# EasyEDA Pro project PCB_SCH_Left_Sub.epro

# Schematic left_sub
Board Name: left_sub; Create Date: 2025-10-24; Page Name: Sheet_1; Project Name: SCH_left_sub; Schematic Name: left_sub; Update Date: 2025-10-23; Add into BOM: yes; Company: Your Company; Convert to PCB: yes; Date: 10/24/2025; Draw By: Habana; REV: 1.0; Sheet: 1/1; spicePre: .
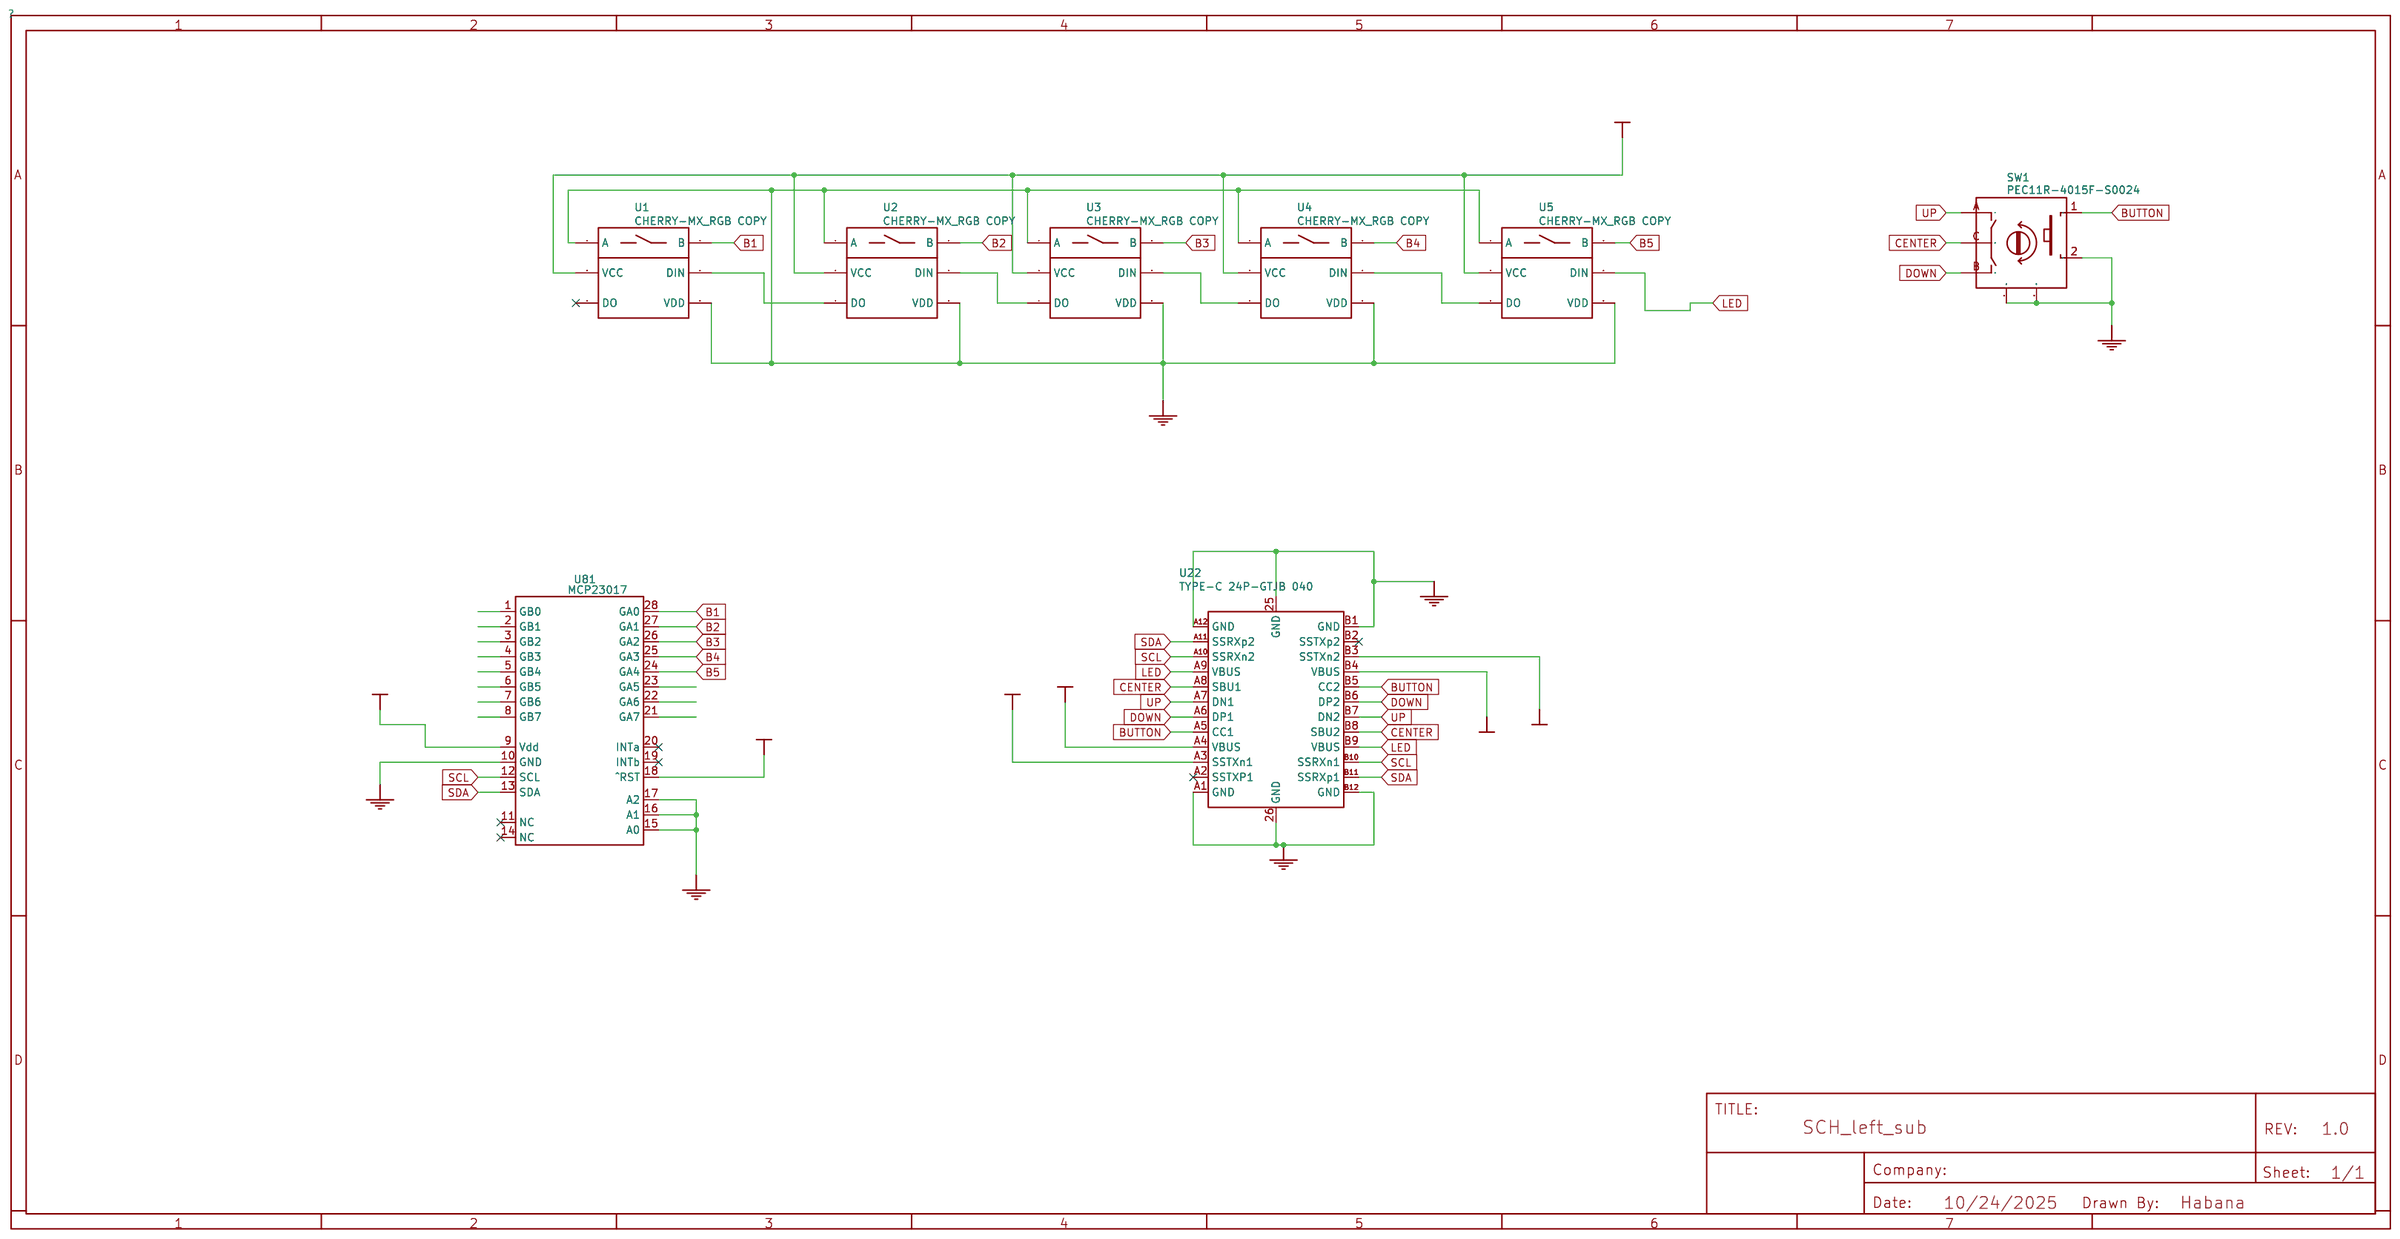
[diagram p0: schematic sheet]

## Parts
SW1  PEC11R-4015F-S0024  [SW-TH_PEC11R-4XXXF-SXXXX]
U1  CHERRY-MX_RGB COPY
U2  CHERRY-MX_RGB COPY
U3  CHERRY-MX_RGB COPY
U4  CHERRY-MX_RGB COPY
U5  CHERRY-MX_RGB COPY
U22  TYPE-C 24P-GTJB 040  [USB-C-SMD_TYPE-C-24P-GTJB-040]
U81  MCP23017

## Library data of the parts
SW1 = PEC11R-4015F-S0024: Supplier: LCSC; Supplier Part: C143789; Manufacturer: BOURNS; JLCPCB Part Class: Extended Part; Contributor: LCSC; spicePre: S
U1-U5 = CHERRY-MX_RGB COPY: Contributor: unrealin01; spicePre: U
U22 = TYPE-C 24P-GTJB 040: Supplier: LCSC; Supplier Part: C3151751; Manufacturer: SHOU HAN(首韩); JLCPCB Part Class: Extended Part; Contributor: lcsc; spicePre: U
U81 = MCP23017: nameAlias: Model; catid: 20; spicePre: X; Contributor: tsvstar

## Nets
+5V: U1.3(VCC) U2.3(VCC) U3.3(VCC) U4.3(VCC) U5.3(VCC) U22.A4(VBUS) U22.B4(VBUS)
GND: SW1.2 SW1.MT1 SW1.MT2 U1.1(A) U1.5(VDD) U2.1(A) U2.5(VDD) U3.1(A) U3.5(VDD) U4.1(A) U4.5(VDD) U5.1(A) U5.5(VDD) U22.25(GND) U22.26(GND) U22.A1(GND) U22.A12(GND) U22.B1(GND) U22.B12(GND) U81.10(GND) U81.15(A0) U81.16(A1) U81.17(A2)
VCC: U22.A3(SSTXn1) U22.B3(SSTXn2) U81.9(Vdd) U81.18(^RST)
B1: U1.2(B) U81.28(GA0)
B2: U2.2(B) U81.27(GA1)
B3: U3.2(B) U81.26(GA2)
B4: U4.2(B) U81.25(GA3)
B5: U5.2(B) U81.24(GA4)
BUTTON: SW1.1 U22.A5(CC1) U22.B5(CC2)
CENTER: SW1.C U22.A8(SBU1) U22.B8(SBU2)
DOWN: SW1.B U22.A6(DP1) U22.B6(DP2)
LED: U5.6(DIN) U22.A9(VBUS) U22.B9(VBUS)
SCL: U22.A10(SSRXn2) U22.B10(SSRXn1) U81.12(SCL)
SDA: U22.A11(SSRXp2) U22.B11(SSRXp1) U81.13(SDA)
UP: SW1.A U22.A7(DN1) U22.B7(DN2)
U2_4: U1.6(DIN) U2.4(DO)
U3_4: U2.6(DIN) U3.4(DO)
U4_4: U3.6(DIN) U4.4(DO)
U5_4: U4.6(DIN) U5.4(DO)

Not connected (* = marked no-connect by the designer): U1 4(DO)*; U22 A2(SSTXP1)* B2(SSTXp2)*; U81 1(GB0) 2(GB1) 3(GB2) 4(GB3) 5(GB4) 6(GB5) 7(GB6) 8(GB7) 11(NC)* 14(NC)* 19(INTb)* 20(INTa)* 21(GA7) 22(GA6) 23(GA5)

# Board PCB_PCB_left_sub
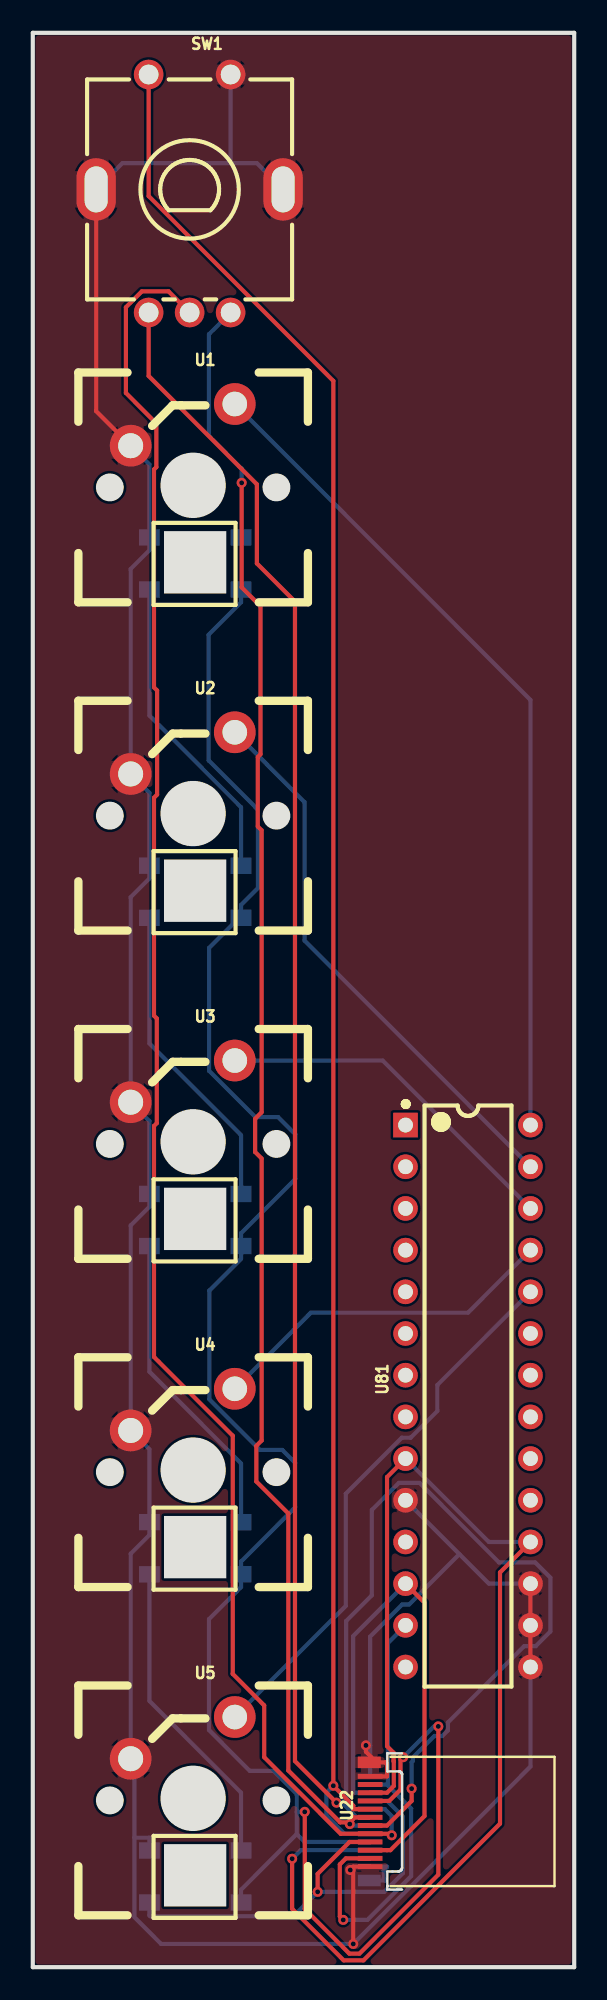
[diagram p1: board, top side]
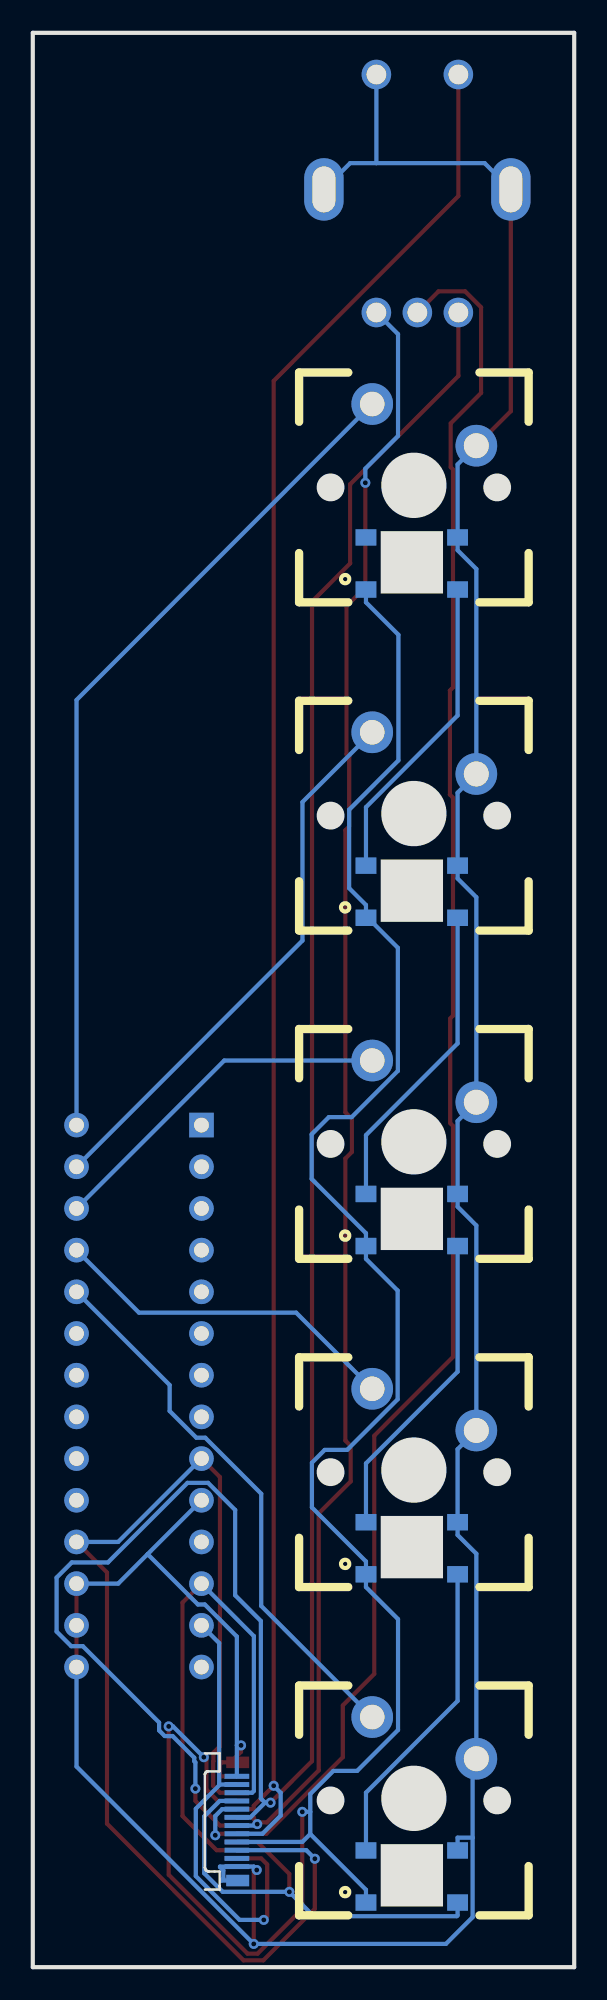
[diagram p2: board, bottom side, seen from below]

Outline 33.02 x 117.86 mm; copper layers: Top Layer, Bottom Layer. Coordinates in mm from the lower left corner of the outline.
Outline path: 0,117.86 33.02,117.86 33.02,0 0,0 0,117.86

## Design rules (mm)
via Default (default): diameter min 0.61, default 0.61, max 100.025; hole min 0.305, default 0.305, max 59.995
pour e399 uses gge3972

## Placement (name value [footprint] x y rotation side)
SW1  PEC11R-4015F-S0024  [SW-TH_PEC11R-4XXXF-SXXXX]  9.56 108.07 0 top
U1  CHERRY-MX_RGB COPY  [CHERRY-MX-RGB]  11.81 83.3 0 top
U2  CHERRY-MX_RGB COPY  [CHERRY-MX-RGB]  11.81 63.3 0 top
U3  CHERRY-MX_RGB COPY  [CHERRY-MX-RGB]  11.81 43.3 0 top
U4  CHERRY-MX_RGB COPY  [CHERRY-MX-RGB]  11.81 23.3 0 top
U5  CHERRY-MX_RGB COPY  [CHERRY-MX-RGB]  11.81 3.3 0 top
U22  TYPE-C 24P-GTJB 040  [USB-C-SMD_TYPE-C-24P-GTJB-040]  20.55 8.88 90 top
U81  MCP23017  [DIP-28_300MIL]  26.54 34.8 90 top

## Footprints (pads in the part's own frame, mm; a bottom-side part is the same pattern mirrored in y, then rotated)
CHERRY-MX-RGB
  round 2.54 hole 1.524: 1(-5.842,9.398)
  round 2.54 hole 1.5: 2(0.508,11.938)
  rect 1.27x1 smd far side: 3(0.889,0.635) 4(0.889,3.81) 5(-4.699,3.81) 6(-4.699,0.635)
DIP-28_300MIL
  rect 1.5x1.5 hole 0.9: 1(16.51,3.81)
  round 1.5 hole 0.9: 2(13.97,3.81) 3(11.43,3.81) 4(8.89,3.81) 5(6.35,3.81) 6(3.81,3.81) 7(1.27,3.81) 8(-1.27,3.81) 9(-3.81,3.81) 10(-6.35,3.81) 11(-8.89,3.81) 12(-11.43,3.81) 13(-13.97,3.81) 14(-16.51,3.81) 15(-16.51,-3.81) 16(-13.97,-3.81) 17(-11.43,-3.81) 18(-8.89,-3.81) 19(-6.35,-3.81) 20(-3.81,-3.81) 21(-1.27,-3.81) 22(1.27,-3.81) 23(3.81,-3.81) 24(6.35,-3.81) 25(8.89,-3.81) 26(11.43,-3.81) 27(13.97,-3.81) 28(16.51,-3.81)
SW-TH_PEC11R-4XXXF-SXXXX
  round 1.8 hole 1.2: 1(-2.5,7.25) 2(2.5,7.25) A(-2.5,-7.25) B(2.5,-7.25) C(0,-7.25)
  oval 2.4x3.8 hole 1.4x2.8: MT1(-5.7,0.25) MT2(5.7,0.25)
USB-C-SMD_TYPE-C-24P-GTJB-040
  rect 0.7x1.4 smd: 25(3.6,0.025)
  rect 0.7x1.4 smd far side: 26(-3.6,0.025)
  rect 0.3x1.5 smd: A1(2.75,-0.025) A2(2.25,-0.025) A3(1.75,-0.025) A4(1.25,-0.025) A5(0.75,-0.025) A6(0.25,-0.025) A7(-0.25,-0.025) A8(-0.75,-0.025) A9(-1.25,-0.025) A10(-1.75,-0.025) A11(-2.25,-0.025) A12(-2.75,-0.025)
  rect 0.3x1.5 smd far side: B1(-2.75,-0.025) B2(-2.25,-0.025) B3(-1.75,-0.025) B4(-1.25,-0.025) B5(-0.75,-0.025) B6(-0.25,-0.025) B7(0.25,-0.025) B8(0.75,-0.025) B9(1.25,-0.025) B10(1.75,-0.025) B11(2.25,-0.025) B12(2.75,-0.025)

## Nets
As in the schematic.

Pads without a net: U1 4; U22 A2 B2; U81 1 2 3 4 5 6 7 8 11 14 19 20 21 22 23

## Via types
v1: diameter 0.61, hole 0.305, Top Layer to Bottom Layer, 15 vias

## Routing (per net, layer and track width the routed paths; a pad name or vN(x,y) marks a point on that pad's centre or on a via; arc(x,y) is an arc through that point)
+5V: length 136.7
  Top Layer w0.254: v1(24.73,14.67) 24.73,5.64 19.92,0.82 19.31,0.82 16.59,3.55 v1(16.59,9.46) ; v1(22.59,12.79) 22.43,12.63 22.43,10.82 21.74,10.13 U22.A4
  Bottom Layer w0.254: 12.7,63.94 12.7,64.05 ; 12.7,64.05 12.7,64.72 13.73,65.74 13.73,70.52 10.72,73.52 10.72,81.18 12.7,83.16 12.7,83.94 ; 12.7,64.05 10.75,62.11 10.75,54.61 13.57,51.79 14.96,51.79 16.01,50.74 16.01,48.03 12.7,44.72 12.7,43.16 10.77,41.23 10.77,34.6 13.85,31.52 15.22,31.52 16,30.74 16,28.01 12.7,24.72 U4.3 12.7,23.16 10.75,21.2 10.75,14.45 13.24,11.96 14.69,11.96 16.1,10.55 16.1,9.46 ; 16.1,9.46 16.1,8.11 ; 16.1,9.46 v1(16.59,9.46) ; v1(22.59,12.79) 24.47,14.67 v1(24.73,14.67) ; 16.1,8.11 12.7,4.72 U5.3 ; 16.1,8.11 16.58,7.63 U22.B4
GND: length 210.7
  Top Layer w0.254: v1(20.32,13.51) 20.32,13.12 20.96,12.48 ; U81.17 U81.16 U81.15 ; 20.96,12.48 21.5,12.48 21.5,12.47 21.6,12.37 21.6,11.63 U22.A1 ; 20.96,12.48 U22.25 ; U22.A12 19.55,6.13 19.55,5.92 ; 19.55,5.92 v1(19.36,5.92) ; 19.55,5.92 v1(19.55,1.42) ; SW1.MT1 3.87,94.8 U1.1
  Bottom Layer w0.254: 20.57,13.51 U22.A1 ; 20.57,13.51 v1(20.32,13.51) ; 20.57,13.51 20.57,20.14 22.53,22.1 22.95,22.1 26.02,25.16 ; 26.02,25.16 27.81,23.37 U81.17 ; 26.02,25.16 U81.10 ; U22.26 21.5,5.28 21.5,5.31 21.4,5.41 21.4,5.9 21.6,6.1 21.6,6.13 U22.A12 19.55,6.13 19.55,6.1 v1(19.36,5.92) ; 6.2,7.89 7.11,7.89 U5.5 ; 6.2,7.89 6.2,3.05 7.83,1.42 v1(19.55,1.42) 30.35,12.22 U81.15 ; 6.2,7.89 6.2,12.47 U5.1 5.97,25.19 7.11,26.33 U4.5 7.11,31.56 U4.1 5.97,45.19 7.11,46.33 U3.5 7.11,51.56 U3.1 5.97,65.19 7.11,66.33 U2.5 7.11,71.56 U2.1 5.97,85.19 7.11,86.33 U1.5 7.11,91.56 U1.1 ; 12.06,109.92 SW1.2 ; 12.06,109.92 13.67,109.92 SW1.MT2 ; 12.06,109.92 5.47,109.92 SW1.MT1
VCC: length 75.3
  Top Layer w0.254: U22.A3 21.6,10.63 22.02,11.04 22.02,12.53 22,12.55 22,13.07 21.6,13.46 21.6,29.86 U81.9 ; U81.18 28.49,24.05 28.49,8.74 20.17,0.42 18.96,0.42 15.82,3.56 v1(15.82,6.61)
  Bottom Layer w0.254: U81.9 27.81,25.91 U81.18 ; U22.B3 16.34,7.13 v1(15.82,6.61)
B1: length 51.4
  Bottom Layer w0.254: U81.28 30.35,77.21 U1.2
B2: length 33.9
  Bottom Layer w0.254: U81.27 16.57,62.55 16.57,70.99 U2.2
B3: length 21.8
  Bottom Layer w0.254: U81.26 21.34,55.24 U3.2
B4: length 21.5
  Bottom Layer w0.254: U81.25 26.54,39.88 16.96,39.88 U4.2
B5: length 33.7
  Bottom Layer w0.254: U5.2 19.09,22.01 19.09,28.85 22.5,32.26 23.04,32.26 24.67,33.89 24.67,35.47 U81.24
BUTTON: length 117
  Top Layer w0.254: U22.A5 19.55,9.63 19.55,9.84 v1(18.33,11.05) 18.33,96.65 7.06,107.91 SW1.1
  Bottom Layer w0.254: v1(18.33,11.05) 17.9,10.63 17.9,9.24 19.02,8.13 U22.B5
CENTER: length 109.5
  Top Layer w0.254: v1(21.89,8.04) 21.8,8.13 U22.A8 18.78,8.13 14.11,12.79 14.11,15.95 12.19,17.87 12.19,32.38 7.39,37.18 7.39,51.25 7.56,51.42 7.56,57.8 7.39,57.97 7.39,71.25 7.58,71.44 7.58,77.78 7.39,77.97 7.39,91.25 7.53,91.39 7.53,94.06 5.68,95.91 5.68,101.13 6.65,102.1 8.28,102.1 SW1.C
  Bottom Layer w0.254: v1(21.89,8.04) 21.89,9.21 21.47,9.63 U22.B8
DOWN: length 100
  Top Layer w0.254: 19.33,8.82 v1(19.33,8.72) ; 19.33,8.82 18.75,8.82 15.58,11.99 15.58,27.64 13.63,29.59 13.63,31.76 13.96,32.09 13.96,49.27 13.56,49.67 13.56,51.69 13.96,52.08 13.96,69.27 13.72,69.5 13.72,73.73 13.89,73.9 13.89,82.92 12.74,84.07 v1(12.74,90.44) ; 19.33,8.82 19.55,9.04 19.55,9.13 U22.A6
  Bottom Layer w0.254: v1(19.33,8.72) 19.42,8.63 U22.B6 ; v1(12.74,90.44) 12.74,91.3 10.75,93.29 10.75,99.5 SW1.B
LED: length 28.3
  Top Layer w0.254: U22.A9 19.32,7.63 17.37,5.68 v1(17.37,4.59)
  Bottom Layer w0.254: U5.6 7.11,3.16 7.16,3.11 15.89,3.11 v1(17.37,4.59) 21.43,4.59 22.56,5.72 22.56,9.19 21.62,10.13 U22.B9
SCL: length 33.9
  Top Layer w0.254: U22.A10 21.81,7.13 23.89,9.21 23.89,22.21 U81.12
  Bottom Layer w0.254: U22.B10 19.65,10.63 19.54,10.74 19.54,20.17 U81.12
SDA: length 28.1
  Top Layer w0.254: v1(18.93,2.88) 18.73,3.09 18.73,6.26 19.09,6.63 U22.A11
  Bottom Layer w0.254: v1(18.93,2.88) 20.41,2.88 23.08,5.55 23.08,9.65 21.6,11.13 ; U22.B11 21.6,11.13 ; 21.6,11.13 21.65,11.18 21.65,19.75 U81.13
U2_4: length 19.1
  Bottom Layer w0.254: 7.11,83.94 7.11,76.26 12.7,70.67 U2.4
U3_4: length 19.1
  Bottom Layer w0.254: U3.4 12.7,50.69 7.11,56.28 7.11,63.94
U4_4: length 19.1
  Bottom Layer w0.254: U4.4 12.7,30.69 7.11,36.28 7.11,43.94
U5_4: length 19.1
  Bottom Layer w0.254: U4.6 7.11,16.22 12.7,10.63 U5.4
UP: length 151.5
  Top Layer w0.254: v1(18.52,10.02) 15.99,12.55 15.99,83.2 13.67,85.53 13.67,90.35 7.06,96.95 SW1.A ; v1(23.1,10.88) 23.1,10.13 21.6,8.63 U22.A7
  Bottom Layer w0.254: v1(23.1,10.88) 23.1,12.48 23.17,12.55 23.17,12.76 24.49,14.08 24.97,14.08 25.32,14.43 25.32,14.91 29.97,19.56 30.68,19.56 31.57,20.45 31.57,23.73 30.64,24.66 28.43,24.66 23.59,29.51 22.33,29.51 20.68,27.86 20.68,22.66 19.11,21.09 19.11,10.28 18.86,10.02 ; 18.86,10.02 19.75,9.13 U22.B7 ; 18.86,10.02 v1(18.52,10.02)

## Copper pours and planes (outline as drawn; the poured copper is in the pictures)
GND on Top Layer: -5.71,121.79 36.7,121.79 39.24,119.25 39.24,-2.41 36.96,-4.7 -0.89,-4.7 -3.94,-1.65
